# Altium schematic sheet Charger.SchDoc
size A4
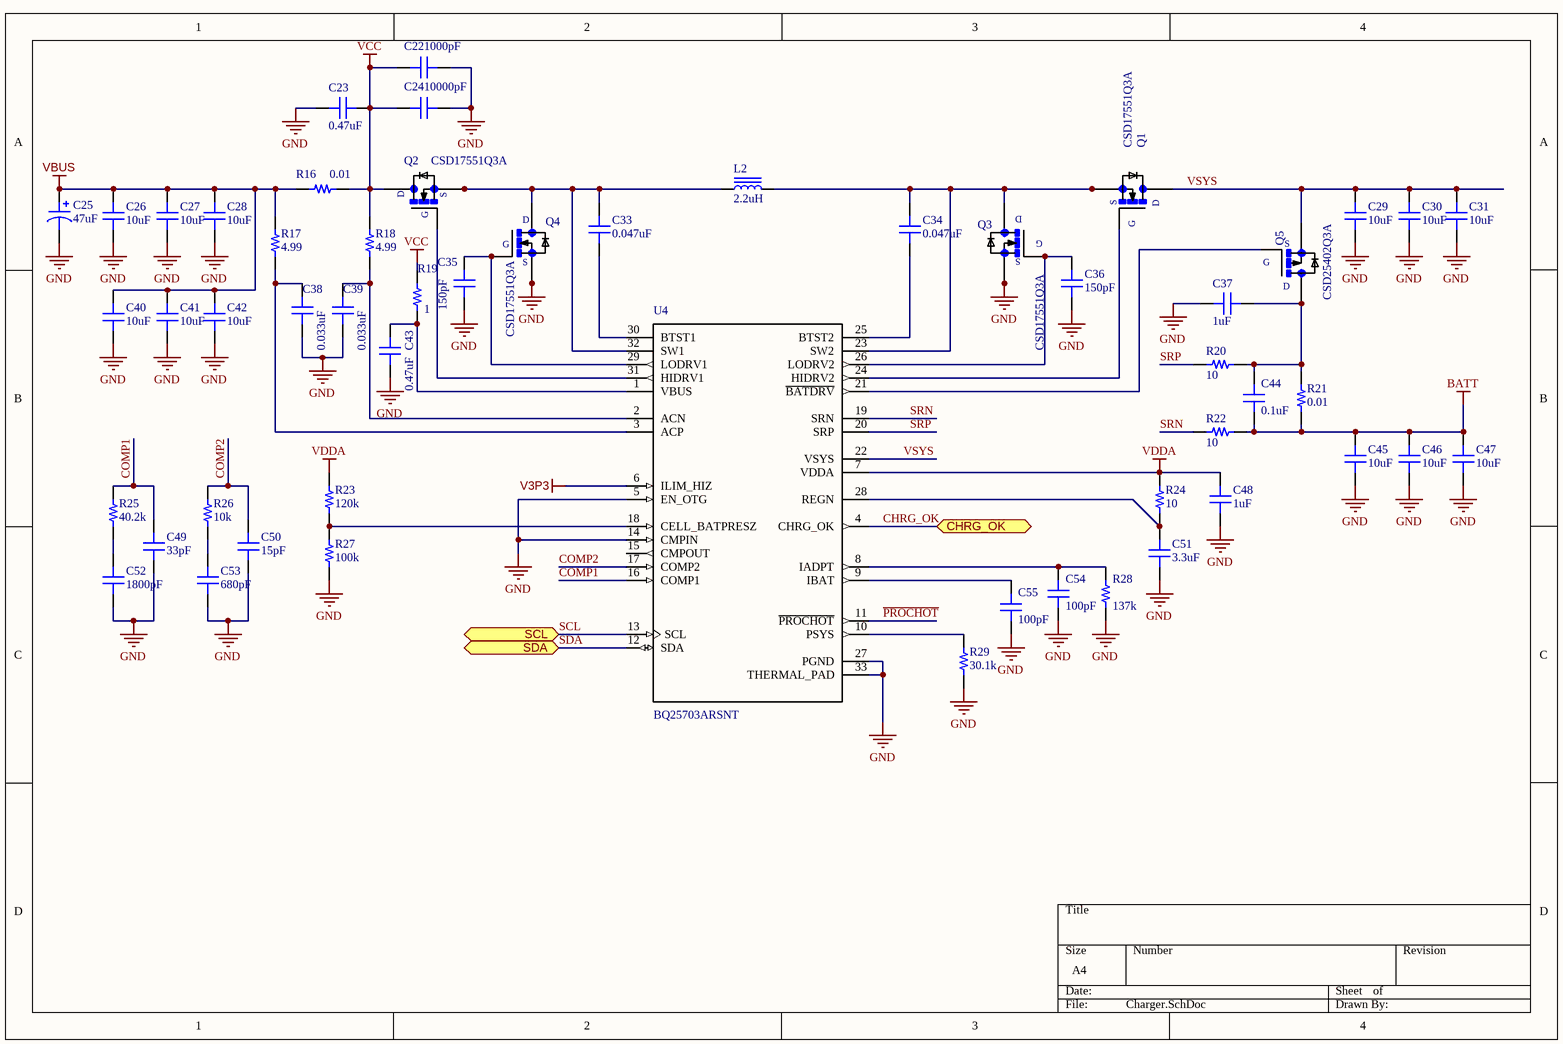
[diagram p0: Charger.SchDoc]

## Parts
C22  1000pF  [CAP 0402/1005]
C23  0.47uF  [CAP 0603/1608]
C24  10000pF  [CAP 0402/1005]
C25  47uF  [CAP POL 2917/7343]
C26  10uF  [CAP 0805/2012]
C27  10uF  [CAP 0805/2012]
C28  10uF  [CAP 0805/2012]
C29  10uF  [CAP 0805/2012]
C30  10uF  [CAP 0805/2012]
C31  10uF  [CAP 0805/2012]
C33  0.047uF  [CAP 0603/1608]
C34  0.047uF  [CAP 0603/1608]
C35  150pF  [CAP 0603/1608]
C36  150pF  [CAP 0603/1608]
C37  1uF  [CAP 0603/1608]
C38  0.033uF  [CAP 0603/1608]
C39  0.033uF  [CAP 0603/1608]
C40  10uF  [CAP 0805/2012]
C41  10uF  [CAP 0805/2012]
C42  10uF  [CAP 0805/2012]
C43  0.47uF  [CAP 0603/1608]
C44  0.1uF  [CAP 0603/1608]
C45  10uF  [CAP 0805/2012]
C46  10uF  [CAP 0805/2012]
C47  10uF  [CAP 0805/2012]
C48  1uF  [CAP 0603/1608]
C49  33pF  [CAP 0603/1608]
C50  15pF  [CAP 0603/1608]
C51  3.3uF  [CAP 0603/1608]
C52  1800pF  [CAP 0603/1608]
C53  680pF  [CAP 0603/1608]
C54  100pF  [CAP 0603/1608]
C55  100pF  [CAP 0603/1608]
L2  2.2uH  [WURTH WE-HCI 7040]
Q1  CSD17551Q3A  [SON65P300X350X90-9N]
Q2  CSD17551Q3A  [SON65P300X350X90-9N]
Q3  CSD17551Q3A  [SON65P300X350X90-9N]
Q4  CSD17551Q3A  [SON65P300X350X90-9N]
Q5  CSD25402Q3A  [SON65P300X350X90-9N]
R16  value 0.01  [STACKPOLE CSR2512]  (hidden comment: CSR25120R01F)
R17  4.99  [RES 0603/1608]
R18  4.99  [RES 0603/1608]
R19  1  [RES 0603/1608]
R20  10  [RES 0402/1005]
R21  value 0.01  [STACKPOLE CSR2512]  (hidden comment: CSR25120R01F)
R22  10  [RES 0402/1005]
R23  120k  [RES 0603/1608]
R24  10  [RES 0603/1608]
R25  40.2k  [RES 0603/1608]
R26  10k  [RES 0603/1608]
R27  100k  [RES 0603/1608]
R28  137k  [RES 0603/1608]
R29  30.1k  [RES 0402/1005]
U4  BQ25703ARSNT  [QFN40P400X400X80-33N]

## Ports
CHRG_OK (bidir, see 2), SCL (bidir, see 2), SDA (bidir, see 2)

## Nets
BATT: C44.1 C45.1 C46.2 C47.2 R21.1 R22.2
GND: C22.2 C23.2 C24.2 C25.2 C26.1 C27.1 C28.1 C29.1 C30.1 C31.1 C35.1 C36.1 C37.1 C38.1 C39.1 C40.1 C41.1 C42.1 C43.2 C45.2 C46.1 C47.1 C48.2 C49.1 C50.1 C51.1 C52.1 C53.1 C54.1 C55.1 Q3.1(S) Q3.2(S) Q3.3(S) Q4.1(S) Q4.2(S) Q4.3(S) R27.1 R28.1 R29.1 U4.5(EN_OTG) U4.14(CMPIN) U4.27(PGND) U4.33(THERMAL_PAD)
V3P3: U4.6(ILIM_HIZ)
VBUS: C25.1 C26.2 C27.2 C28.2 C40.2 C41.2 C42.2 R16.1 R17.2
VCC: C22.1 C23.1 C24.1 Q2.5(D) R16.2 R18.2 R19.1
VDDA: C48.1 R23.2 R24.2 U4.7(VDDA)
CHRG_OK: U4.4(CHRG_OK) ; port CHRG_OK
COMP1: C49.2 R25.2 U4.16(COMP1)
COMP2: C50.2 R26.2 U4.17(COMP2)
~{PROCHOT}: U4.11(~{PROCHOT})
SCL: U4.13(SCL) ; port SCL
SDA: U4.12(SDA) ; port SDA
SRN: R22.1 U4.19(SRN)
SRP: R20.1 U4.20(SRP)
VSYS: C29.2 C30.2 C31.2 Q1.5(D) Q5.5(D) U4.22(VSYS)
NetC33_1: C33.1 U4.30(BTST1)
NetC33_2: C33.2 L2.1 Q2.1(S) Q2.2(S) Q2.3(S) Q4.5(D) U4.32(SW1)
NetC34_1: C34.1 U4.25(BTST2)
NetC34_2: C34.2 L2.2 Q1.1(S) Q1.2(S) Q1.3(S) Q3.5(D) U4.23(SW2)
NetC35_2: C35.2 Q4.4(G) U4.29(LODRV1)
NetC36_2: C36.2 Q3.4(G) U4.26(LODRV2)
NetC37_2: C37.2 C44.2 Q5.1(S) Q5.2(S) Q5.3(S) R20.2 R21.2
NetC38_2: C38.2 R17.1 U4.3(ACP)
NetC39_2: C39.2 R18.1 U4.2(ACN)
NetC43_1: C43.1 R19.2 U4.1(VBUS)
NetC51_2: C51.2 R24.1 U4.28(REGN)
NetC52_2: C52.2 R25.1
NetC53_2: C53.2 R26.1
NetC54_2: C54.2 R28.2 U4.8(IADPT)
NetC55_2: C55.2 U4.9(IBAT)
NetQ1_4: Q1.4(G) U4.24(HIDRV2)
NetQ2_4: Q2.4(G) U4.31(HIDRV1)
NetQ5_4: Q5.4(G) U4.21(~{BATDRV})
NetR23_1: R23.1 R27.2 U4.18(CELL_BATPRESZ)
NetR29_2: R29.2 U4.10(PSYS)

Not connected (* = marked no-connect by the designer): U4 15(CMPOUT)

## Library data of the parts
C22 = GRM155R61H102KA01D: CAP CER 1000PF 50V X5R 0402; Manufacturer: Murata Electronics North America; TemperatureRange: -55C ~ 85C; Tolerance: 10%; Value: 1000pF; Part Number: GRM155R61H102KA01D; PartId: 12849; Supplier 1: Digi-Key; Supplier Part Number 1: 490-6316-2-ND; ComponentLink1Description: Datasheet; ComponentLink1URL: http://www.murata.com/~/media/webrenewal/support/library/catalog/products/capacitor/mlcc/c02e.pdf; ComponentLink2Description: Digi-Key Listing; ComponentLink2URL: https://www.digikey.com/product-detail/en/murata-electronics-north-america/GRM155R61H102KA01D/490-6316-2-ND/2610872; TemperatureCoefficient: X5R; Voltage: 50V; Price: 0,0039; Device Package: 0402 (1005 Metric)
C23 = C1608X7R1H474K080AC: CAP CER 0.47UF 50V X7R 0603; Manufacturer: TDK Corporation; TemperatureRange: -55C ~ 125C; Tolerance: 10%; Value: 0.47uF; Part Number: C1608X7R1H474K080AC; PartId: 4043; Supplier 1: Digi-Key; Supplier Part Number 1: 445-5952-1-ND; ComponentLink1Description: Datasheet; ComponentLink1URL: https://product.tdk.com/info/en/catalog/datasheets/mlcc_commercial_general_en.pdf; ComponentLink2Description: Digi-Key listing; ComponentLink2URL: http://digikey.com/product-detail/en/C1608X7R1H474K080AC/445-5952-1-ND/2443993; TemperatureCoefficient: X7R; Voltage: 50V; Price: 0,34; Type: -; Device Package: 0603 (1608 Metric)
C24 = GCM155R71H103KA55D: CAP CER 10000PF 50V X7R 0402; Manufacturer: Murata Electronics North America; TemperatureRange: -55C ~ 125C; Tolerance: 10%; Value: 10000pF; Part Number: GCM155R71H103KA55D; PartId: 12381; Supplier 1: Digi-Key; Supplier Part Number 1: 490-4762-2-ND; ComponentLink1Description: Datasheet; ComponentLink1URL: http://www.murata.com/~/media/webrenewal/support/library/catalog/products/capacitor/mlcc/c03e.ashx; ComponentLink2Description: Digi-Key Listing; ComponentLink2URL: https://www.digikey.com/product-detail/en/murata-electronics-north-america/GCM155R71H103KA55D/490-4762-2-ND/1641636; TemperatureCoefficient: X7R; Voltage: 50V; Price: 0,0067; Device Package: 0402 (1005 Metric)
C25 = T491X476M035AT: CAP TANT 47UF 35V 20% 2917; Manufacturer: Kemet; TemperatureRange: -55C ~ 125C; Type: General Purpose; Value: 47uF; Part Number: T491X476M035AT; PartId: 6949; Supplier 1: Digi-Key; Supplier Part Number 1: 399-8421-2-ND; ComponentLink1Description: Datasheet; ComponentLink1URL: http://www.kemet.com/Lists/ProductCatalog/Attachments/254/KEM_T2005_T491.pdf; ComponentLink2Description: Digi-Key listing; ComponentLink2URL: http://digikey.com/product-detail/en/T491X476M035AT/399-8421-2-ND/2336393; Tolerance: 20%; Voltage: 35V; Price: 1,3769; Device Package: 2917 (7343 Metric)
C26-C31 C40-C42 C45-C47 = C2012X5R1V106M085AC: CAP CER 10UF 35V X5R 0805; Manufacturer: TDK Corporation; TemperatureRange: -55C ~ 85C; Tolerance: 20%; Value: 10uF; Part Number: C2012X5R1V106M085AC; PartId: 4768; Supplier 1: Digi-Key; Supplier Part Number 1: 445-14419-2-ND; ComponentLink1Description: Datasheet; ComponentLink1URL: https://product.tdk.com/info/en/catalog/datasheets/mlcc_commercial_general_en.pdf; ComponentLink2Description: Digi-Key listing; ComponentLink2URL: http://digikey.com/product-detail/en/C2012X5R1V106M085AC/445-14419-2-ND/3951655; TemperatureCoefficient: X5R; Voltage: 35V; Price: 0,2152; Type: -; Device Package: 0805 (2012 Metric)
C33 C34 = 500R14W473KV4T: CAP CER 0.047UF 50V X7R 0603; Manufacturer: Johanson Dielectrics Inc.; TemperatureRange: -55C ~ 125C; Tolerance: 10%; Value: 0.047uF; Part Number: 500R14W473KV4T; PartId: 30591; Supplier 1: Digi-Key; Supplier Part Number 1: 709-1165-2-ND; ComponentLink1Description: Datasheet; ComponentLink1URL: https://www.johansondielectrics.com/downloads/jdi-product-catalog.pdf; ComponentLink2Description: Digi-Key Listing; ComponentLink2URL: https://www.digikey.com/product-detail/en/johanson-dielectrics-inc/500R14W473KV4T/709-1165-2-ND/1859410; TemperatureCoefficient: X7R; Voltage: 50V; Price: 0; Device Package: 0603 (1608 Metric)
C35 C36 = C1608C0G1H151K080AA: CAP CER 150PF 50V C0G 0603; Manufacturer: TDK Corporation; TemperatureRange: -55C ~ 125C; TemperatureCoefficient: C0G, NP0; Tolerance: 10%; Value: 150pF; Part Number: C1608C0G1H151K080AA; PartId: 4298; Supplier 1: Digi-Key; Supplier Part Number 1: 445-13973-1-ND; ComponentLink1Description: Datasheet; ComponentLink1URL: https://product.tdk.com/info/en/catalog/datasheets/mlcc_commercial_general_en.pdf; ComponentLink2Description: Digi-Key listing; ComponentLink2URL: http://digikey.com/product-detail/en/C1608C0G1H151K080AA/445-13973-1-ND/3955639; Voltage: 50V; Price: 0,14; Type: -; Device Package: 0603 (1608 Metric)
C37 C48 = GRM188R7YA105KA12D: CAP CER 1UF 35V X7R 0603; Manufacturer: Murata Electronics North America; TemperatureRange: -55C ~ 125C; Tolerance: 10%; Type: Derating Recommended; Value: 1uF; Part Number: GRM188R7YA105KA12D; PartId: 5658; Supplier 1: Digi-Key; Supplier Part Number 1: 490-10487-2-ND; ComponentLink1Description: Datasheet; ComponentLink1URL: http://www.murata.com/~/media/webrenewal/support/library/catalog/products/capacitor/mlcc/c02e.ashx; ComponentLink2Description: Digi-Key listing; ComponentLink2URL: http://digikey.com/product-detail/en/GRM188R7YA105KA12D/490-10487-2-ND/5027572; TemperatureCoefficient: X7R; Voltage: 35V; Price: 0,0735; Device Package: 0603 (1608 Metric)
C38 C39 = C1608X7R1H333K080AA: CAP CER 0.033UF 50V X7R 0603; Manufacturer: TDK Corporation; TemperatureRange: -55C ~ 125C; Tolerance: 10%; Value: 0.033uF; Part Number: C1608X7R1H333K080AA; PartId: 4079; Supplier 1: Digi-Key; Supplier Part Number 1: 445-5093-1-ND; ComponentLink1Description: Datasheet; ComponentLink1URL: https://product.tdk.com/info/en/catalog/datasheets/mlcc_commercial_general_en.pdf; ComponentLink2Description: Digi-Key listing; ComponentLink2URL: http://digikey.com/product-detail/en/C1608X7R1H333K080AA/445-5093-1-ND/2093708; TemperatureCoefficient: X7R; Voltage: 50V; Price: 0,14; Type: -; Device Package: 0603 (1608 Metric)
C43 = UMK107ABJ474KA-T: CAP CER 0.47UF 50V X5R 0603; Manufacturer: Taiyo Yuden; TemperatureRange: -55C ~ 85C; Tolerance: 10%; Value: 0.47uF; Part Number: UMK107ABJ474KA-T; PartId: 13181; Supplier 1: Digi-Key; Supplier Part Number 1: 587-3171-2-ND; ComponentLink1Description: Datasheet; ComponentLink1URL: //media.digikey.com/pdf/Data%20Sheets/Taiyo%20Yuden%20PDFs%20URL%20links/UMK107ABJ474KA-T.pdf; ComponentLink2Description: Digi-Key Listing; ComponentLink2URL: https://www.digikey.com/product-detail/en/taiyo-yuden/UMK107ABJ474KA-T/587-3171-2-ND/3194980; TemperatureCoefficient: X5R; Voltage: 50V; Price: 0,0156; Device Package: 0603 (1608 Metric)
C44 = C1608X7R1E104K080AA: CAP CER 0.1UF 25V X7R 0603; Manufacturer: TDK Corporation; TemperatureRange: -55C ~ 125C; Tolerance: 10%; Value: 0.1uF; Part Number: C1608X7R1E104K080AA; PartId: 4029; Supplier 1: Digi-Key; Supplier Part Number 1: 445-1316-1-ND; ComponentLink1Description: Datasheet; ComponentLink1URL: https://product.tdk.com/info/en/catalog/datasheets/mlcc_commercial_general_en.pdf; ComponentLink2Description: Digi-Key listing; ComponentLink2URL: http://digikey.com/product-detail/en/C1608X7R1E104K080AA/445-1316-1-ND/567697; TemperatureCoefficient: X7R; Voltage: 25V; Price: 0,14; Type: -; Device Package: 0603 (1608 Metric)
C49 = CC0603JRNPO9BN330: CAP CER 33PF 50V NPO 0603; Manufacturer: Yageo; TemperatureRange: -55C ~ 125C; TemperatureCoefficient: C0G, NP0; Tolerance: 5%; Value: 33pF; Part Number: CC0603JRNPO9BN330; PartId: 5290; Supplier 1: Digi-Key; Supplier Part Number 1: 311-1064-2-ND; ComponentLink1Description: Datasheet; ComponentLink1URL: http://www.yageo.com/documents/recent/UPY-GP_NP0_16V-to-50V_10.pdf; ComponentLink2Description: Digi-Key listing; ComponentLink2URL: http://digikey.com/product-detail/en/CC0603JRNPO9BN330/311-1064-2-ND/302798; Voltage: 50V; Price: 0,0075; Type: -; Device Package: 0603 (1608 Metric)
C50 = 500R14N150JV4T: CAP CER 15PF 50V C0G/NP0 0603; Manufacturer: Johanson Dielectrics Inc.; TemperatureRange: -55C ~ 125C; TemperatureCoefficient: C0G, NP0; Tolerance: 5%; Value: 15pF; Part Number: 500R14N150JV4T; PartId: 30768; Supplier 1: Digi-Key; Supplier Part Number 1: 709-1142-2-ND; ComponentLink1Description: Datasheet; ComponentLink1URL: https://www.johansondielectrics.com/downloads/jdi-product-catalog.pdf; ComponentLink2Description: Digi-Key Listing; ComponentLink2URL: https://www.digikey.com/product-detail/en/johanson-dielectrics-inc/500R14N150JV4T/709-1142-2-ND/1859387; Voltage: 50V; Price: 0; Device Package: 0603 (1608 Metric)
C51 = C1608X5R1C335K080AC: CAP CER 3.3UF 16V X5R 0603; Manufacturer: TDK Corporation; TemperatureRange: -55C ~ 85C; Tolerance: 10%; Value: 3.3uF; Part Number: C1608X5R1C335K080AC; PartId: 13059; Supplier 1: Digi-Key; Supplier Part Number 1: 445-7476-2-ND; ComponentLink1Description: Datasheet; ComponentLink1URL: https://product.tdk.com/info/en/catalog/datasheets/mlcc_commercial_general_en.pdf; ComponentLink2Description: Digi-Key Listing; ComponentLink2URL: https://www.digikey.com/product-detail/en/tdk-corporation/C1608X5R1C335K080AC/445-7476-2-ND/2732911; TemperatureCoefficient: X5R; Voltage: 16V; Price: 0,0555; Device Package: 0603 (1608 Metric)
C52 = CL10B182KB8NNNC: CAP CER 1800PF 50V X7R 0603; Manufacturer: Samsung Electro-Mechanics America, Inc.; TemperatureRange: -55C ~ 125C; Tolerance: 10%; Value: 1800pF; Part Number: CL10B182KB8NNNC; PartId: 5348; Supplier 1: Digi-Key; Supplier Part Number 1: 1276-1976-2-ND; ComponentLink1Description: Datasheet; ComponentLink1URL: http://www.samsungsem.com/kr/support/product-search/mlcc/CL10B182KB8NNNC.jsp; ComponentLink2Description: Digi-Key listing; ComponentLink2URL: http://digikey.com/product-detail/en/CL10B182KB8NNNC/1276-1976-2-ND/3887634; TemperatureCoefficient: X7R; Voltage: 50V; Price: 0,0097; Type: -; Device Package: 0603 (1608 Metric)
C53 = CL10B681KB8NNNC: CAP CER 680PF 50V X7R 0603; Manufacturer: Samsung Electro-Mechanics America, Inc.; TemperatureRange: -55C ~ 125C; Tolerance: 10%; Value: 680pF; Part Number: CL10B681KB8NNNC; PartId: 5326; Supplier 1: Digi-Key; Supplier Part Number 1: 1276-1080-2-ND; ComponentLink1Description: Datasheet; ComponentLink1URL: http://www.samsungsem.com/kr/support/product-search/mlcc/CL10B681KB8NNNC.jsp; ComponentLink2Description: Digi-Key listing; ComponentLink2URL: http://digikey.com/product-detail/en/CL10B681KB8NNNC/1276-1080-2-ND/3886738; TemperatureCoefficient: X7R; Voltage: 50V; Price: 0,0086; Type: -; Device Package: 0603 (1608 Metric)
C54 C55 = CL10C101KB8NNNC: CAP CER 100PF 50V NP0 0603; Manufacturer: Samsung Electro-Mechanics America, Inc.; TemperatureRange: -55C ~ 125C; TemperatureCoefficient: C0G, NP0; Tolerance: 10%; Value: 100pF; Part Number: CL10C101KB8NNNC; PartId: 5284; Supplier 1: Digi-Key; Supplier Part Number 1: 1276-2167-2-ND; ComponentLink1Description: Datasheet; ComponentLink1URL: http://www.samsungsem.com/kr/support/product-search/mlcc/CL10C101KB8NNNC.jsp; ComponentLink2Description: Digi-Key listing; ComponentLink2URL: http://digikey.com/product-detail/en/CL10C101KB8NNNC/1276-2167-2-ND/3887825; Voltage: 50V; Price: 0,0069; Type: -; Device Package: 0603 (1608 Metric)
L2 = 744311220: FIXED IND 2.2UH 9A 11.4 MOHM SMD; Manufacturer: Wurth Electronics Inc; Type: Wirewound; Tolerance: 20%; Shielding: Shielded; Frequency - Self Resonant: 52MHz; Value: 2.2uH; Part Number: 744311220; PartId: 9682; Supplier 1: Digi-Key; Supplier Part Number 1: 732-1151-2-ND; ComponentLink1Description: Datasheet; ComponentLink1URL: http://katalog.we-online.de/pbs/datasheet/744311220.pdf; ComponentLink2Description: Digi-Key Listing; ComponentLink2URL: https://www.digikey.com/product-detail/en/744311220/732-1151-2-ND/1638556; Price: 2,85; Device Package: Nonstandard; Series: WE-HCI; Inductance: 2.2uH; Current Rating: 9A; DC Resistance (DCR): 11.4 mOhm; Q @ Freq: -; Operating Temperature: -40C ~ 150C
Q1-Q4 = CSD17551Q3A: Trans MOSFET N-CH 30V 48A 8-Pin VSONP EP T/R; MF: Texas Instruments; Price: None; Package: SON-8 Texas Instruments; MP: CSD17551Q3A; SnapEDA_Link: https://www.snapeda.com/parts/CSD17551Q3A/Texas%20Instruments/view-part/?ref=snap; Availability: Unavailable; Value: *
Q5 = CSD25402Q3A: Trans MOSFET P-CH –20 V -15A NexFET™ Power MOSFET; MF: Texas Instruments; MP: CSD17551Q3A; Price: None; Package: SON-8 Texas Instruments; SnapEDA_Link: https://www.snapeda.com/parts/CSD17551Q3A/Texas%20Instruments/view-part/?ref=snap; Availability: Unavailable; Value: *
R16 R21 = CSR25120R01F: RES SMD 0.01 OHM 1% 1W 2512; Manufacturer: Riedon; TemperatureRange: -55C ~ 170C; TemperatureCoefficient: 75ppm/C; Part Number: CSR25120R01F; PartId: 21369; Supplier 1: Digi-Key; Supplier Part Number 1: 696-1655-2-ND; ComponentLink1Description: Datasheet; ComponentLink1URL: http://riedon.com/media/pdf/CSR.pdf; ComponentLink2Description: Digi-Key Listing; ComponentLink2URL: https://www.digikey.com/product-detail/en/riedon/CSR25120R01F/696-1655-2-ND/5723617; Tolerance: 1%; PowerRating: 1W; Price: 0,1729; Device Package: 2512 (6432 Metric)
R17 R18 = RC0603FR-074R99L: RES SMD 4.99 OHM 1% 1/10W 0603; Manufacturer: Yageo; TemperatureRange: -55C ~ 155C; TemperatureCoefficient: 200ppm/C; PowerRating: 0.1W, 1/10W; Value: 4.99; Part Number: RC0603FR-074R99L; PartId: 27963; Supplier 1: Digi-Key; Supplier Part Number 1: 311-4.99HRCT-ND; ComponentLink1Description: Datasheet; ComponentLink1URL: http://www.yageo.com/NewPortal/yageodocoutput?fileName=/pdf/R-Chip/PYu-RC_Group_51_RoHS_L_4.pdf; ComponentLink2Description: Digi-Key Listing; ComponentLink2URL: https://www.digikey.com/product-detail/en/yageo/RC0603FR-074R99L/311-4.99HRCT-ND/730165; Tolerance: 1%; Price: 0,1; Device Package: 0603 (1608 Metric)
R19 = RCS06031R00JNEA: RES SMD 1 OHM 5% 1/4W 0603; Manufacturer: Vishay Dale; TemperatureRange: -55C ~ 155C; TemperatureCoefficient: 200ppm/C; PowerRating: 0.25W, 1/4W; Value: 1; Part Number: RCS06031R00JNEA; PartId: 28337; Supplier 1: Digi-Key; Supplier Part Number 1: 541-2805-1-ND; ComponentLink1Description: Datasheet; ComponentLink1URL: http://www.vishay.com/docs/20065/rcse3.pdf; ComponentLink2Description: Digi-Key Listing; ComponentLink2URL: https://www.digikey.com/product-detail/en/vishay-dale/RCS06031R00JNEA/541-2805-1-ND/5867098; Tolerance: 5%; Price: 0,14; Device Package: 0603 (1608 Metric)
R20 R22 = ERJ-2RKF10R0X: RES SMD 10 OHM 1% 1/10W 0402; Manufacturer: Panasonic Electronic Components; TemperatureRange: -55C ~ 155C; TemperatureCoefficient: 100ppm/C; PowerRating: 0.1W, 1/10W; Value: 10; Part Number: ERJ-2RKF10R0X; PartId: 14; Supplier 1: Digi-Key; Supplier Part Number 1: P10.0LTR-ND; ComponentLink1Description: Datasheet; ComponentLink1URL: http://industrial.panasonic.com/www-cgi/jvcr13pz.cgi?E+PZ+3+AOA0002+ERJ2RKF10R0X+7+WW; ComponentLink2Description: Digikey listing; ComponentLink2URL: http://digikey.com/product-detail/en/ERJ-2RKF10R0X/P10.0LTR-ND/192072; Tolerance: 1%; Price: 0,0043; Type: Thick Film; Device Package: 0402 (1005 Metric)
R23 = ERJ-3EKF1203V: RES SMD 120K OHM 1% 1/10W 0603; Manufacturer: Panasonic Electronic Components; TemperatureRange: -55C ~ 155C; TemperatureCoefficient: 100ppm/C; PowerRating: 0.1W, 1/10W; Value: 120k; Part Number: ERJ-3EKF1203V; PartId: 962; Supplier 1: Digi-Key; Supplier Part Number 1: P120KHTR-ND; ComponentLink1Description: Datasheet; ComponentLink1URL: http://industrial.panasonic.com/www-cgi/jvcr13pz.cgi?E+PZ+3+AOA0002+ERJ3EKF1203V+7+WW; ComponentLink2Description: Digi-Key listing; ComponentLink2URL: http://digikey.com/product-detail/en/ERJ-3EKF1203V/P120KHTR-ND/1746307; Tolerance: 1%; Price: 0,0038; Type: Thick Film; Device Package: 0603 (1608 Metric)
R24 = RMCF0603FT10R0: RES SMD 10 OHM 1% 1/10W 0603; Manufacturer: Stackpole Electronics Inc.; TemperatureRange: -55C ~ 155C; TemperatureCoefficient: 100ppm/C; PowerRating: 0.1W, 1/10W; Value: 10; Part Number: RMCF0603FT10R0; PartId: 27980; Supplier 1: Digi-Key; Supplier Part Number 1: RMCF0603FT10R0CT-ND; ComponentLink1Description: Datasheet; ComponentLink1URL: https://www.seielect.com/Catalog/SEI-RMCF_RMCP.pdf; ComponentLink2Description: Digi-Key Listing; ComponentLink2URL: https://www.digikey.com/product-detail/en/stackpole-electronics-inc/RMCF0603FT10R0/RMCF0603FT10R0CT-ND/1942943; Tolerance: 1%; Price: 0,1; Device Package: 0603 (1608 Metric)
R25 = ERJ-3EKF4022V: RES SMD 40.2K OHM 1% 1/10W 0603; Manufacturer: Panasonic Electronic Components; TemperatureRange: -55C ~ 155C; TemperatureCoefficient: 100ppm/C; PowerRating: 0.1W, 1/10W; Value: 40.2k; Part Number: ERJ-3EKF4022V; PartId: 1077; Supplier 1: Digi-Key; Supplier Part Number 1: P40.2KHTR-ND; ComponentLink1Description: Datasheet; ComponentLink1URL: http://industrial.panasonic.com/www-cgi/jvcr13pz.cgi?E+PZ+3+AOA0002+ERJ3EKF4022V+7+WW; ComponentLink2Description: Digi-Key listing; ComponentLink2URL: http://digikey.com/product-detail/en/ERJ-3EKF4022V/P40.2KHTR-ND/196343; Tolerance: 1%; Price: 0,0038; Type: Thick Film; Device Package: 0603 (1608 Metric)
R26 = ERJ-3EKF1002V: RES SMD 10K OHM 1% 1/10W 0603; Manufacturer: Panasonic Electronic Components; TemperatureRange: -55C ~ 155C; TemperatureCoefficient: 100ppm/C; PowerRating: 0.1W, 1/10W; Value: 10k; Part Number: ERJ-3EKF1002V; PartId: 886; Supplier 1: Digi-Key; Supplier Part Number 1: P10.0KHTR-ND; ComponentLink1Description: Datasheet; ComponentLink1URL: http://industrial.panasonic.com/www-cgi/jvcr13pz.cgi?E+PZ+3+AOA0002+ERJ3EKF1002V+7+WW; ComponentLink2Description: Digi-Key listing; ComponentLink2URL: http://digikey.com/product-detail/en/ERJ-3EKF1002V/P10.0KHTR-ND/196066; Tolerance: 1%; Price: 0,0038; Type: Thick Film; Device Package: 0603 (1608 Metric)
R27 = ERJ-3EKF1003V: RES SMD 100K OHM 1% 1/10W 0603; Manufacturer: Panasonic Electronic Components; TemperatureRange: -55C ~ 155C; TemperatureCoefficient: 100ppm/C; PowerRating: 0.1W, 1/10W; Value: 100k; Part Number: ERJ-3EKF1003V; PartId: 887; Supplier 1: Digi-Key; Supplier Part Number 1: P100KHTR-ND; ComponentLink1Description: Datasheet; ComponentLink1URL: http://industrial.panasonic.com/www-cgi/jvcr13pz.cgi?E+PZ+3+AOA0002+ERJ3EKF1003V+7+WW; ComponentLink2Description: Digi-Key listing; ComponentLink2URL: http://digikey.com/product-detail/en/ERJ-3EKF1003V/P100KHTR-ND/196075; Tolerance: 1%; Price: 0,0038; Type: Thick Film; Device Package: 0603 (1608 Metric)
R28 = ERJ-3EKF1373V: RES SMD 137K OHM 1% 1/10W 0603; Manufacturer: Panasonic Electronic Components; TemperatureRange: -55C ~ 155C; TemperatureCoefficient: 100ppm/C; PowerRating: 0.1W, 1/10W; Value: 137k; Part Number: ERJ-3EKF1373V; PartId: 1208; Supplier 1: Digi-Key; Supplier Part Number 1: P137KHTR-ND; ComponentLink1Description: Datasheet; ComponentLink1URL: http://industrial.panasonic.com/www-cgi/jvcr13pz.cgi?E+PZ+3+AOA0002+ERJ3EKF1373V+7+WW; ComponentLink2Description: Digi-Key listing; ComponentLink2URL: http://digikey.com/product-detail/en/ERJ-3EKF1373V/P137KHTR-ND/196120; Tolerance: 1%; Price: 0,0038; Type: Thick Film; Device Package: 0603 (1608 Metric)
R29 = ERJ-2RKF3012X: RES SMD 30.1K OHM 1% 1/10W 0402; Manufacturer: Panasonic Electronic Components; TemperatureRange: -55C ~ 155C; TemperatureCoefficient: 100ppm/C; PowerRating: 0.1W, 1/10W; Value: 30.1k; Part Number: ERJ-2RKF3012X; PartId: 178; Supplier 1: Digi-Key; Supplier Part Number 1: P30.1KLTR-ND; ComponentLink1Description: Datasheet; ComponentLink1URL: http://industrial.panasonic.com/www-cgi/jvcr13pz.cgi?E+PZ+3+AOA0002+ERJ2RKF3012X+7+WW; ComponentLink2Description: Digikey listing; ComponentLink2URL: http://digikey.com/product-detail/en/ERJ-2RKF3012X/P30.1KLTR-ND/192290; Tolerance: 1%; Price: 0,0043; Type: Thick Film; Device Package: 0402 (1005 Metric)
U4 = BQ25703ARSNT: NVDC I2C Battery Buck-Boost Charge Controller with System Power Monitor & Processor 32-QFN -40 to 85; MF: Texas Instruments; Price: None; Package: QFN-32 Texas Instruments; MP: BQ25703ARSNT; SnapEDA_Link: https://www.snapeda.com/parts/BQ25703ARSNT/Texas%20Instruments/view-part/?ref=snap; Availability: Unavailable; Value: *